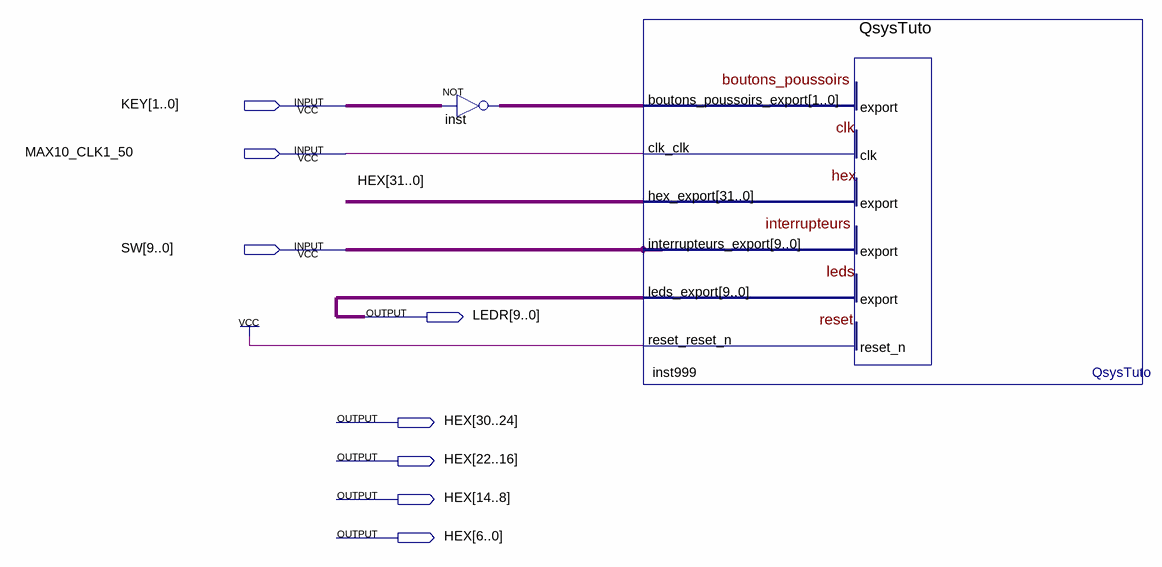
[diagram p0: schematic sheet]
// Quartus schematic TD_SEME.bdf as structural Verilog: 2 symbols, 8 pins
module TD_SEME (
  input  [1:0] KEY,
  input  MAX10_CLK1_50,
  input  [9:0] SW,
  output [9:0] LEDR,
  output [31:0] HEX
);

  wire [1:0] inst_out;

  assign inst_out = ~KEY;  // NOT inst, 2 bits wide
  QsysTuto inst999 (
    .boutons_poussoirs_export(inst_out), .clk_clk(MAX10_CLK1_50), .interrupteurs_export(SW),
    .reset_reset_n(1'b1), .hex_export(HEX), .leds_export(LEDR));
endmodule
